# Altium project ArmPCBPrj.PrjPCB
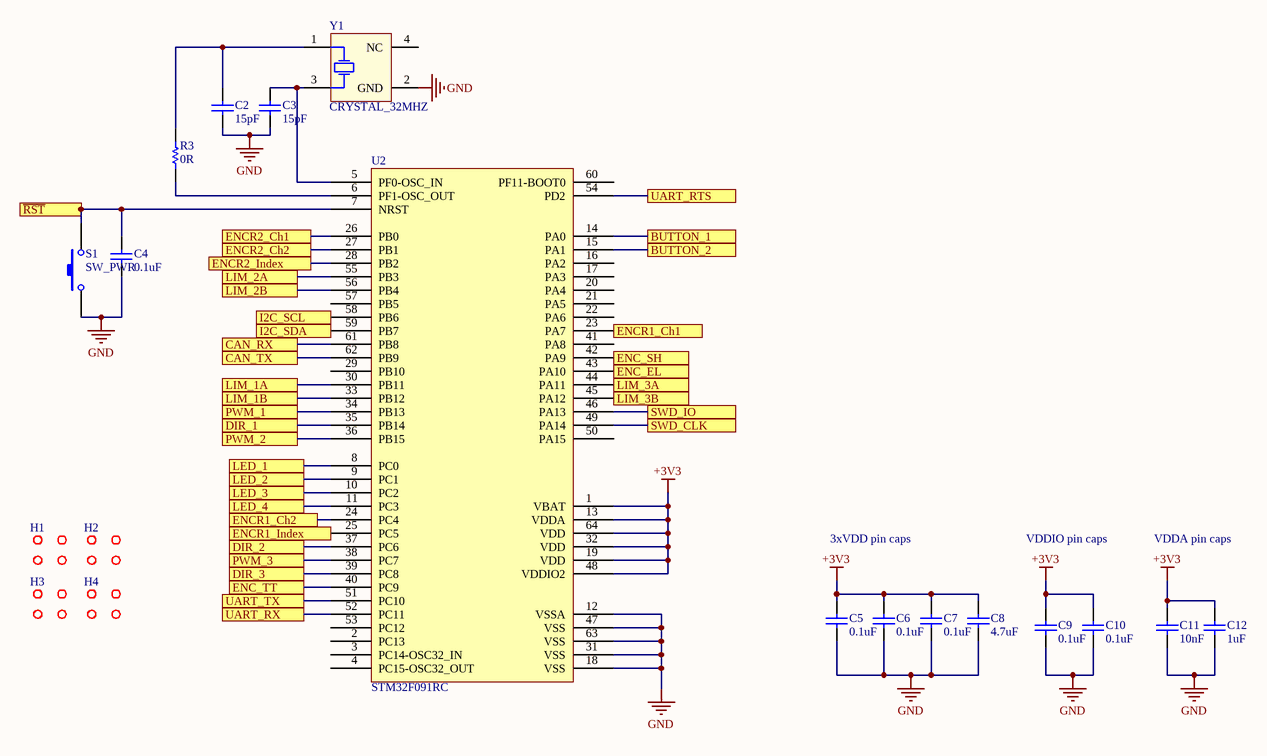
[diagram p0: MCU.SchDoc]
2 sheets, 47 parts. Net scope: flat (ports and power ports of the same name join across sheets).
Board files: ArmPCB.PcbDoc, ArmRev2.PcbDoc
Sheets:
  MCU.SchDoc
  Support.SchDoc

## Sheet MCU.SchDoc
size A4

### Parts
C2  value 15pF  [CAPC0603(1608)55_N]  (hidden comment: CAP_15pF_0603)
C3  value 15pF  [CAPC0603(1608)55_N]  (hidden comment: CAP_15pF_0603)
C4  value 0.1uF  [CAPC0603(1608)55_N]  (hidden comment: CAP_0.1uF_16V_0603)
C5  value 0.1uF  [CAPC0603(1608)55_N]  (hidden comment: CAP_0.1uF_16V_0603)
C6  value 0.1uF  [CAPC0603(1608)55_N]  (hidden comment: CAP_0.1uF_16V_0603)
C7  value 0.1uF  [CAPC0603(1608)55_N]  (hidden comment: CAP_0.1uF_16V_0603)
C8  value 4.7uF  [CAPC0603(1608)55_N]  (hidden comment: CAP_4.7uF_0603)
C9  value 0.1uF  [CAPC0603(1608)55_N]  (hidden comment: CAP_0.1uF_16V_0603)
C10  value 0.1uF  [CAPC0603(1608)55_N]  (hidden comment: CAP_0.1uF_16V_0603)
C11  value 10nF  [CAPC0603(1608)55_N]  (hidden comment: CAP_10nF_0603)
C12  value 1uF  [CAPC0603(1608)55_N]  (hidden comment: CAP_1uF_16V_0603)
H1  MOUNTING_HOLES  [MOUNTING_HOLE]  (value not drawn)
H2  MOUNTING_HOLES  [MOUNTING_HOLE]  (value not drawn)
H3  MOUNTING_HOLES  [MOUNTING_HOLE]  (value not drawn)
H4  MOUNTING_HOLES  [MOUNTING_HOLE]  (value not drawn)
R3  value 0R  [RESC0603(1608)_N]  (hidden comment: RES_0R_0603)
S1  SW_PWR  [PTS830GM140]
U2  STM32F091RC  [STM_LQFP64_N]
Y1  CRYSTAL_32MHZ  [AVX-CX2520DB32000D0GEJZ1-4_V]

### Ports
BUTTON_1, BUTTON_2, CAN_RX, CAN_TX, DIR_1, DIR_2, DIR_3, ENC_EL, ENC_SH, ENC_TT, ENCR1_Ch1, ENCR1_Ch2, ENCR1_Index, ENCR2_Ch1, ENCR2_Ch2, ENCR2_Index, I2C_SCL, I2C_SDA, LED_1, LED_2, LED_3, LED_4, LIM_1A, LIM_1B, LIM_2A, LIM_2B, LIM_3A, LIM_3B, PWM_1, PWM_2, PWM_3, SWD_CLK, SWD_IO, UART_RTS, UART_RX, UART_TX, ~{RST}

### Nets
+3V3: C5.2 C6.2 C7.2 C8.2 C9.2 C10.2 C11.2 C12.2 U2.1(VBAT) U2.13(VDDA) U2.19(VDD) U2.32(VDD) U2.48(VDDIO2) U2.64(VDD)
GND: C2.1 C3.1 C4.1 C5.1 C6.1 C7.1 C8.1 C9.1 C10.1 C11.1 C12.1 S1.1 U2.12(VSSA) U2.18(VSS) U2.31(VSS) U2.47(VSS) U2.63(VSS) Y1.2(GND)
BUTTON_1: U2.14(PA0) ; port BUTTON_1
BUTTON_2: U2.15(PA1) ; port BUTTON_2
I2C_SCL: U2.58(PB6) ; port I2C_SCL
I2C_SDA: U2.59(PB7) ; port I2C_SDA
LED_1: U2.8(PC0) ; port LED_1
LED_2: U2.9(PC1) ; port LED_2
LED_3: U2.10(PC2) ; port LED_3
LED_4: U2.11(PC3) ; port LED_4
LIM_1A: U2.30(PB11) ; port LIM_1A
LIM_1B: U2.33(PB12) ; port LIM_1B
LIM_2A: U2.55(PB3) ; port LIM_2A
LIM_2B: U2.56(PB4) ; port LIM_2B
LIM_3A: U2.44(PA11) ; port LIM_3A
LIM_3B: U2.45(PA12) ; port LIM_3B
UART_RTS: U2.54(PD2) ; port UART_RTS
UART_RX: U2.52(PC11) ; port UART_RX
UART_TX: U2.51(PC10) ; port UART_TX
NetC2_2: C2.2 R3.2 Y1.1(HOT)
NetC3_2: C3.2 U2.5(PF0-OSC_IN) Y1.3(HOT)
NetC4_2: C4.2 S1.2 U2.7(NRST) ; port ~{RST}
NetR3_1: R3.1 U2.6(PF1-OSC_OUT)
NetR12_2: U2.38(PC7) ; port PWM_3
NetR13_2: U2.36(PB15) ; port PWM_2
NetR14_2: U2.34(PB13) ; port PWM_1
NetU2_23: U2.23(PA7) ; port ENCR1_Ch1
NetU2_24: U2.24(PC4) ; port ENCR1_Ch2
NetU2_25: U2.25(PC5) ; port ENCR1_Index
NetU2_26: U2.26(PB0) ; port ENCR2_Ch1
NetU2_27: U2.27(PB1) ; port ENCR2_Ch2
NetU2_28: U2.28(PB2) ; port ENCR2_Index
NetU2_35: U2.35(PB14) ; port DIR_1
NetU2_37: U2.37(PC6) ; port DIR_2
NetU2_39: U2.39(PC8) ; port DIR_3
NetU2_40: U2.40(PC9) ; port ENC_TT
NetU2_42: U2.42(PA9) ; port ENC_SH
NetU2_43: U2.43(PA10) ; port ENC_EL
NetU2_46: U2.46(PA13) ; port SWD_IO
NetU2_49: U2.49(PA14) ; port SWD_CLK
NetU2_61: U2.61(PB8) ; port CAN_RX
NetU2_62: U2.62(PB9) ; port CAN_TX

Not connected (* = marked no-connect by the designer): U2 2(PC13) 3(PC14-OSC32_IN) 4(PC15-OSC32_OUT) 16(PA2) 17(PA3) 20(PA4) 21(PA5) 22(PA6) 29(PB10) 41(PA8) 50(PA15) 53(PC12) 57(PB5) 60(PF11-BOOT0); Y1 4(NC)

### Notes on the sheet
- 3xVDD pin caps
- VDDIO pin caps
- VDDA pin caps

### Library data of the parts
C2 C3 = CAP_15pF_0603: CAP CER 15PF 250V NPO 0603; Manufacturer: Yageo; MPN: AC0603JRNPOYBN150; Temperature Coefficient: NP0; Dimensions: 0.063" L x 0.031" W (1.60mm x 0.80mm); Package: 0603 (1608 Metric); Voltage Rating: 250v; Digikey Part Number: 311-3282-1-ND
C4-C7 C9 C10 = CAP_0.1uF_16V_0603: CAP CER 0.1UF 16V X7R 0603; Manufacturer: Yageo; MPN: CC0603KRX7R7BB104; Dimensions: 0.063" L x 0.031" W (1.60mm x 0.80mm); Package: 0603 (1608 Metric); Temperature Coefficient: X7R; Voltage Rating: 16V; Digikey Part Number: 311-1088-1-ND
C8 = CAP_4.7uF_0603: CAP CER 4.7UF 6.3V X5R 0603; Manufacturer: Yageo; MPN: CC0603KRX5R5BB475; Dimensions: 0.063" L x 0.031" W (1.60mm x 0.80mm); Package: 0603 (1608 Metric); Temperature Coefficient: X5R; Voltage Rating: 6.3V; Digikey Part Number: 311-1521-1-ND
C11 = CAP_10nF_0603: CAP CER 10000PF 16V X7R 0603; Manufacturer: Yageo; MPN: CC0603KRX7R7BB103; Dimensions: 0.063" L x 0.031" W (1.60mm x 0.80mm); Package: 0603 (1608 Metric); Temperature Coefficient: X7R; Voltage Rating: 16V; Digikey Part Number: 311-3369-1-ND
C12 = CAP_1uF_16V_0603: CAP CER 1UF 16V Y5V 0603; Manufacturer: Yageo; MPN: CC0603ZRY5V7BB105; Dimensions: 0.063" L x 0.031" W (1.60mm x 0.80mm); Package: 0603 (1608 Metric); Temperature Coefficient: Y5V; Voltage Rating: 16V; Digikey Part Number: 311-1372-1-ND
H1-H4 = MOUNTING_HOLES: 6cm x 6cm
R3 = RES_0R_0603: RES SMD 0 OHM JUMPER 1/10W 0603; Manufacturer: Yageo; MPN: RC0603JR-070RL; Package: 0603 (1608 Metric); Dimensions: 0.063" L x 0.031" W (1.60mm x 0.80mm); Digikey Part Number: 311-0.0GRCT-ND
S1 = SW_PWR: Power Switch (Red); pin to pad: 2>4; MPN: PTS830GM140 SMTR LFS; Manufacturer: C&K; ComponentLink1Description: Datasheet; ComponentLink1URL: https://www.ckswitches.com/media/1478/pts830.pdf; Digikey Part Number: CKN10587CT-ND
U2 = STM32F091RC: Manufacturer: STMicroelectronics; Package: 64-LQFP; ComponentLink1Description: Datasheet; ComponentLink1URL: https://www.st.com/content/ccc/resource/technical/document/datasheet/95/3c/2e/5b/21/09/45/a6/DM00115237.pdf/files/DM00115237.pdf/jcr:content/translations/en.DM00115237.pdf#%5B%7B%22num%22%3A96%2C%22gen%22%3A0%7D%2C%7B%22name%22%3A%22XYZ%22%7D%2C67%2C755%2Cnull%5D; MPN: STM32F091RC; Digikey Part Number: 497-15167-ND
Y1 = CRYSTAL_32MHZ: CRYSTAL 32MHZ 8PF SMD; Manufacturer: Kyocera International Inc. Electronic Components; MPN: CX2520DB32000D0GPSC1; Package: 4-SMD, No Lead; Dimensions: 0.098" L x 0.079" W (2.50mm x 2.00mm); Digikey Part Number: 1253-1730-1-ND

## Sheet Support.SchDoc
size A4
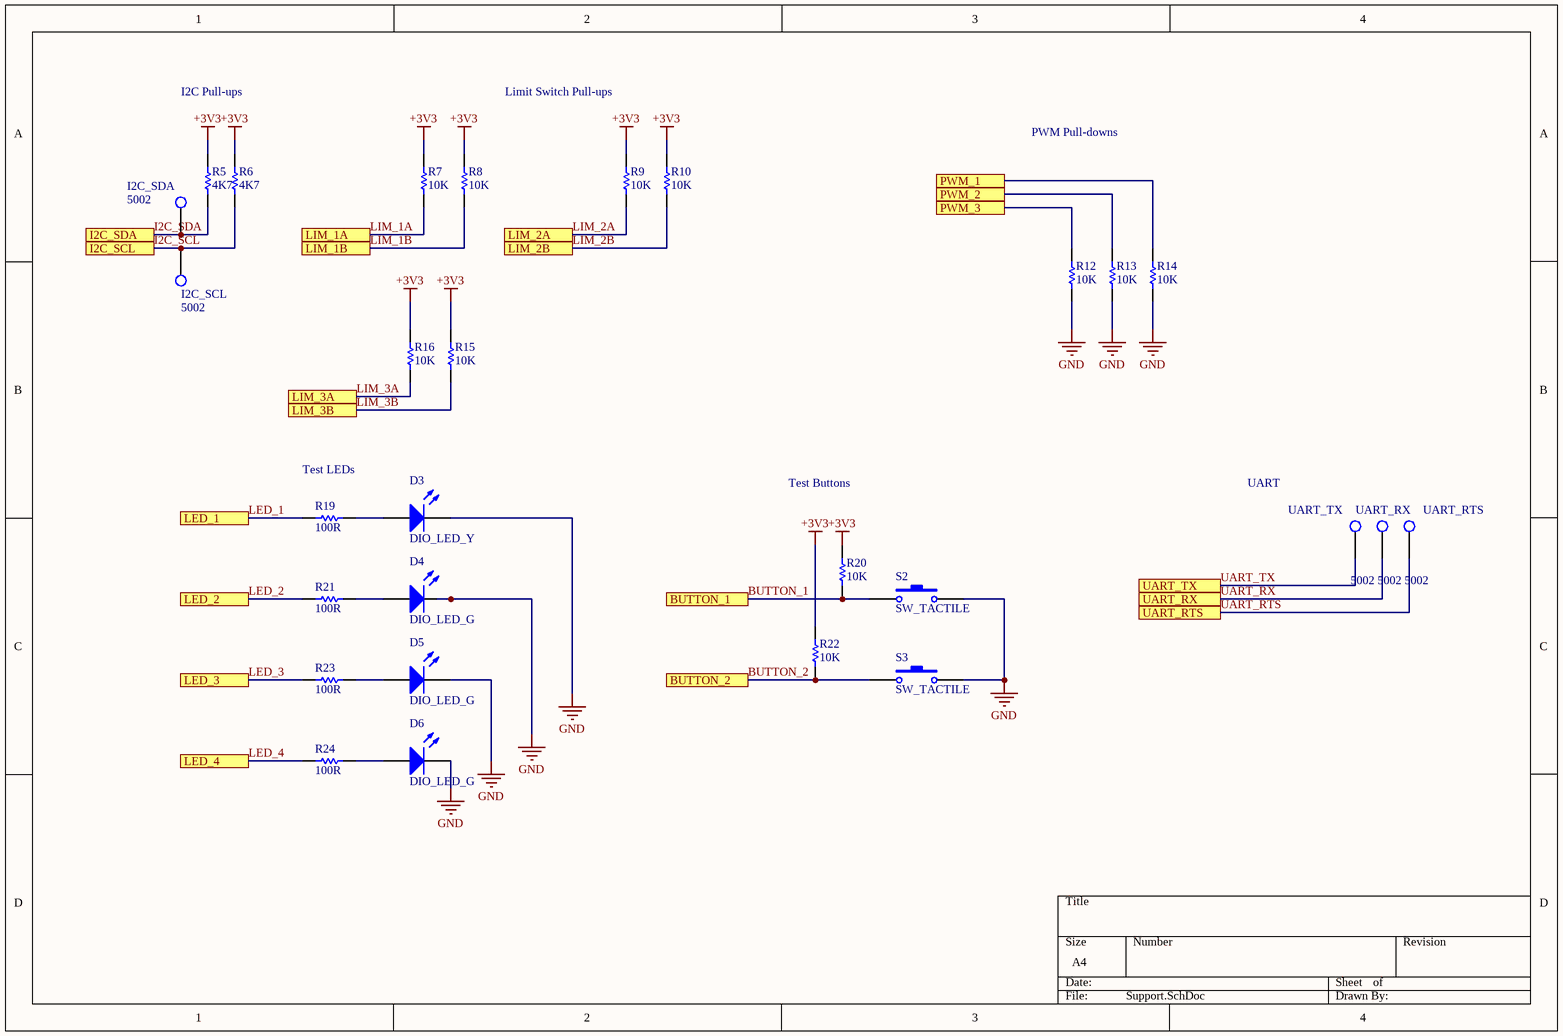
[diagram p1: Support.SchDoc]

### Parts
D3  DIO_LED_Y  [LED_0805_LINE]
D4  DIO_LED_G  [LED_0805_LINE]
D5  DIO_LED_G  [LED_0805_LINE]
D6  DIO_LED_G  [LED_0805_LINE]
R5  value 4K7  [RESC0603(1608)_N]  (hidden comment: RES_4K7_0603)
R6  value 4K7  [RESC0603(1608)_N]  (hidden comment: RES_4K7_0603)
R7  value 10K  [RESC0603(1608)_N]  (hidden comment: RES_10K_0603)
R8  value 10K  [RESC0603(1608)_N]  (hidden comment: RES_10K_0603)
R9  value 10K  [RESC0603(1608)_N]  (hidden comment: RES_10K_0603)
R10  value 10K  [RESC0603(1608)_N]  (hidden comment: RES_10K_0603)
R12  value 10K  [RESC0603(1608)_N]  (hidden comment: RES_10K_0603)
R13  value 10K  [RESC0603(1608)_N]  (hidden comment: RES_10K_0603)
R14  value 10K  [RESC0603(1608)_N]  (hidden comment: RES_10K_0603)
R15  value 10K  [RESC0603(1608)_N]  (hidden comment: RES_10K_0603)
R16  value 10K  [RESC0603(1608)_N]  (hidden comment: RES_10K_0603)
R19  value 100R  [RESC0603(1608)_N]  (hidden comment: RES_100R_0603)
R20  value 10K  [RESC0603(1608)_N]  (hidden comment: RES_10K_0603)
R21  value 100R  [RESC0603(1608)_N]  (hidden comment: RES_100R_0603)
R22  value 10K  [RESC0603(1608)_N]  (hidden comment: RES_10K_0603)
R23  value 100R  [RESC0603(1608)_N]  (hidden comment: RES_100R_0603)
R24  value 100R  [RESC0603(1608)_N]  (hidden comment: RES_100R_0603)
S2  SW_TACTILE  [B3U-1100P]
S3  SW_TACTILE  [B3U-1100P]
TP6  I2C_SDA  MPN: 5002  [TESTPOINT_LOOP]
TP7  I2C_SCL  MPN: 5002  [TESTPOINT_LOOP]
TP8  UART_TX  MPN: 5002  [TESTPOINT_LOOP]
TP9  UART_RX  MPN: 5002  [TESTPOINT_LOOP]
TP10  UART_RTS  MPN: 5002  [TESTPOINT_LOOP]

### Ports
BUTTON_1, BUTTON_2, I2C_SCL, I2C_SDA, LED_1, LED_2, LED_3, LED_4, LIM_1A, LIM_1B, LIM_2A, LIM_2B, LIM_3A, LIM_3B, PWM_1, PWM_2, PWM_3, UART_RTS, UART_RX, UART_TX

### Nets
+3V3: R5.2 R6.2 R7.2 R8.2 R9.2 R10.2 R15.2 R16.2 R20.2 R22.1
GND: D3.2(K) D4.2(K) D5.2(K) D6.2(K) R12.1 R13.1 R14.1 S2.2 S3.2
BUTTON_1: R20.1 S2.1 ; port BUTTON_1
BUTTON_2: R22.2 S3.1 ; port BUTTON_2
I2C_SCL: R6.1 TP7.1(=value) ; port I2C_SCL
I2C_SDA: R5.1 TP6.1(=value) ; port I2C_SDA
LED_1: R19.1 ; port LED_1
LED_2: R21.1 ; port LED_2
LED_3: R23.1 ; port LED_3
LED_4: R24.1 ; port LED_4
LIM_1A: R7.1 ; port LIM_1A
LIM_1B: R8.1 ; port LIM_1B
LIM_2A: R9.1 ; port LIM_2A
LIM_2B: R10.1 ; port LIM_2B
LIM_3A: R16.1 ; port LIM_3A
LIM_3B: R15.1 ; port LIM_3B
UART_RTS: TP10.1(=value) ; port UART_RTS
UART_RX: TP9.1(=value) ; port UART_RX
UART_TX: TP8.1(=value) ; port UART_TX
NetD3_1: D3.1(A) R19.2
NetD4_1: D4.1(A) R21.2
NetD5_1: D5.1(A) R23.2
NetD6_1: D6.1(A) R24.2
NetR12_2: R12.2 ; port PWM_3
NetR13_2: R13.2 ; port PWM_2
NetR14_2: R14.2 ; port PWM_1

### Notes on the sheet
- I2C Pull-ups
- Limit Switch Pull-ups
- PWM Pull-downs
- (near R19) Test LEDs
- Test Buttons
- UART

### Library data of the parts
D3 = DIO_LED_Y: LED YELLOW DIFFUSED 0805 SMD; Manufacturer: OSRAM; MPN: LY R976-PS-36; Forward Voltage Drop: 2.2V; Package: 0805 (2012 Metric); Digikey Part Number: 475-2560-1-ND
D4-D6 = DIO_LED_G: LED GREEN DIFFUSED 0805 SMD; Manufacturer: OSRAM; MPN: LG R971-KN-1; Forward Voltage Drop: 2.2V; Package: 0805 (2012 Metric); Digikey Part Number: 475-1410-1-ND
R5 R6 = RES_4K7_0603: RES SMD 4.7K OHM 5% 1/10W 0603; Manufacturer: Yageo; MPN: RC0603JR-074K7L; Package: 0603 (1608 Metric); Dimensions: 0.063" L x 0.031" W (1.60mm x 0.80mm); Tolerance: 5%; Digikey Part Number: 311-4.7KGRCT-ND
R7-R10 R12-R16 R20 R22 = RES_10K_0603: RES SMD 10K OHM 5% 1/10W 0603; Manufacturer: Yageo; MPN: RC0603JR-0710KL; Package: 0603 (1608 Metric); Dimensions: 0.063" L x 0.031" W (1.60mm x 0.80mm); Tolerance: 5%; Digikey Part Number: 311-10KGRCT-ND
R19 R21 R23 R24 = RES_100R_0603: RES SMD 100 OHM 1% 1/10W 0603; Manufacturer: Yageo; MPN: RC0603FR-07100RL; Package: 0603 (1608 Metric); Dimensions: 0.063" L x 0.031" W (1.60mm x 0.80mm); Tolerance: 1%; Digikey Part Number: 311-100HRCT-ND
S2 S3 = SW_TACTILE: Tactile Switch (Grey); Manufacturer: Omron Electronics Inc-EMC Div; Digikey Part Number: SW1021TR-ND; MPN: B3U-1100P
TP6-TP10 = TESTPOINT_LOOP: PC TEST POINT MINIATURE WHITE; Manufacturer: Keystone Electronics; Digikey Part Number: 36-5002-ND

## Nets that join several sheets
+3V3: MCU (14 pins), Support (10 pins)
GND: MCU (18 pins), Support (9 pins)
BUTTON_1: MCU (U2.14), Support (R20.1 S2.1)
BUTTON_2: MCU (U2.15), Support (R22.2 S3.1)
I2C_SCL: MCU (U2.58), Support (R6.1 TP7.1)
I2C_SDA: MCU (U2.59), Support (R5.1 TP6.1)
LED_1: MCU (U2.8), Support (R19.1)
LED_2: MCU (U2.9), Support (R21.1)
LED_3: MCU (U2.10), Support (R23.1)
LED_4: MCU (U2.11), Support (R24.1)
LIM_1A: MCU (U2.30), Support (R7.1)
LIM_1B: MCU (U2.33), Support (R8.1)
LIM_2A: MCU (U2.55), Support (R9.1)
LIM_2B: MCU (U2.56), Support (R10.1)
LIM_3A: MCU (U2.44), Support (R16.1)
LIM_3B: MCU (U2.45), Support (R15.1)
NetR12_2: MCU (U2.38), Support (R12.2)
NetR13_2: MCU (U2.36), Support (R13.2)
NetR14_2: MCU (U2.34), Support (R14.2)
UART_RTS: MCU (U2.54), Support (TP10.1)
UART_RX: MCU (U2.52), Support (TP9.1)
UART_TX: MCU (U2.51), Support (TP8.1)